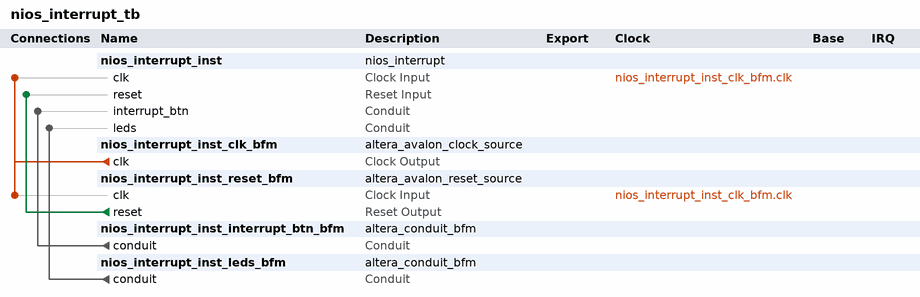
[diagram p0: system contents]
# Platform Designer (Qsys) system nios_interrupt_tb, Cyclone IV E EP4CE6E22C8
# Parameters at their usual value, and those the tool derives, are not listed.
package require -exact qsys 13.0
create_system nios_interrupt_tb
set_project_property DEVICE_FAMILY {Cyclone IV E}
set_project_property DEVICE EP4CE6E22C8

add_instance nios_interrupt_inst nios_interrupt 1.0

add_instance nios_interrupt_inst_clk_bfm altera_avalon_clock_source 13.0

add_instance nios_interrupt_inst_reset_bfm altera_avalon_reset_source 13.0
set_instance_parameter_value nios_interrupt_inst_reset_bfm ASSERT_HIGH_RESET 0
set_instance_parameter_value nios_interrupt_inst_reset_bfm INITIAL_RESET_CYCLES 50

add_instance nios_interrupt_inst_interrupt_btn_bfm altera_conduit_bfm 13.0
set_instance_parameter_value nios_interrupt_inst_interrupt_btn_bfm CLOCKED_SIGNAL false
set_instance_parameter_value nios_interrupt_inst_interrupt_btn_bfm ENABLE_RESET false
set_instance_parameter_value nios_interrupt_inst_interrupt_btn_bfm SIGNAL_WIDTHS 1
set_instance_parameter_value nios_interrupt_inst_interrupt_btn_bfm SIGNAL_DIRECTIONS output

add_instance nios_interrupt_inst_leds_bfm altera_conduit_bfm 13.0
set_instance_parameter_value nios_interrupt_inst_leds_bfm CLOCKED_SIGNAL false
set_instance_parameter_value nios_interrupt_inst_leds_bfm ENABLE_RESET false
set_instance_parameter_value nios_interrupt_inst_leds_bfm SIGNAL_WIDTHS 4
set_instance_parameter_value nios_interrupt_inst_leds_bfm SIGNAL_DIRECTIONS input

# connections
add_connection nios_interrupt_inst_clk_bfm.clk nios_interrupt_inst.clk clock
add_connection nios_interrupt_inst_clk_bfm.clk nios_interrupt_inst_reset_bfm.clk clock
add_connection nios_interrupt_inst_reset_bfm.reset nios_interrupt_inst.reset reset
add_connection nios_interrupt_inst_interrupt_btn_bfm.conduit nios_interrupt_inst.interrupt_btn conduit
add_connection nios_interrupt_inst_leds_bfm.conduit nios_interrupt_inst.leds conduit

set_interconnect_requirement {$system} qsys_mm.clockCrossingAdapter HANDSHAKE
set_interconnect_requirement {$system} qsys_mm.maxAdditionalLatency 1

save_system nios_interrupt_tb.qsys
